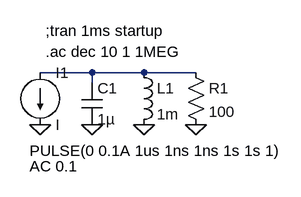
[diagram p0: schematic t5.asc]
t5.asc, the LTspice schematic file:
Version 4
SHEET 1 880 680
WIRE 112 112 32 112
WIRE 192 112 112 112
WIRE 272 112 192 112
WIRE 112 128 112 112
FLAG 32 192 0
FLAG 112 192 0
FLAG 192 192 0
FLAG 272 192 0
SYMBOL current 32 112 R0
SYMATTR InstName I1
SYMBOL cap 96 128 R0
SYMATTR InstName C1
SYMATTR Value 1µ
SYMBOL ind 176 96 R0
SYMATTR InstName L1
SYMATTR Value 1m
SYMBOL res 256 96 R0
SYMATTR InstName R1
SYMATTR Value 100
TEXT 16 232 Left 2 !PULSE(0 0.1A 1us 1ns 1ns 1s 1s 1)
TEXT 16 256 Left 2 !AC 0.1
TEXT 40 48 Left 2 !;tran 1ms startup
TEXT 40 80 Left 2 !.ac dec 10 1 1MEG

The netlist it stands for:
* t5.asc
I1 N001 0 I
C1 N001 0 1µ
L1 N001 0 1m
R1 N001 0 100
PULSE(0 0.1A 1us 1ns 1ns 1s 1s 1)
AC 0.1
;tran 1ms startup
.ac dec 10 1 1MEG
.backanno
.end